# EAGLE design AUDIO_SHIELD (EAGLE 7.5.0)
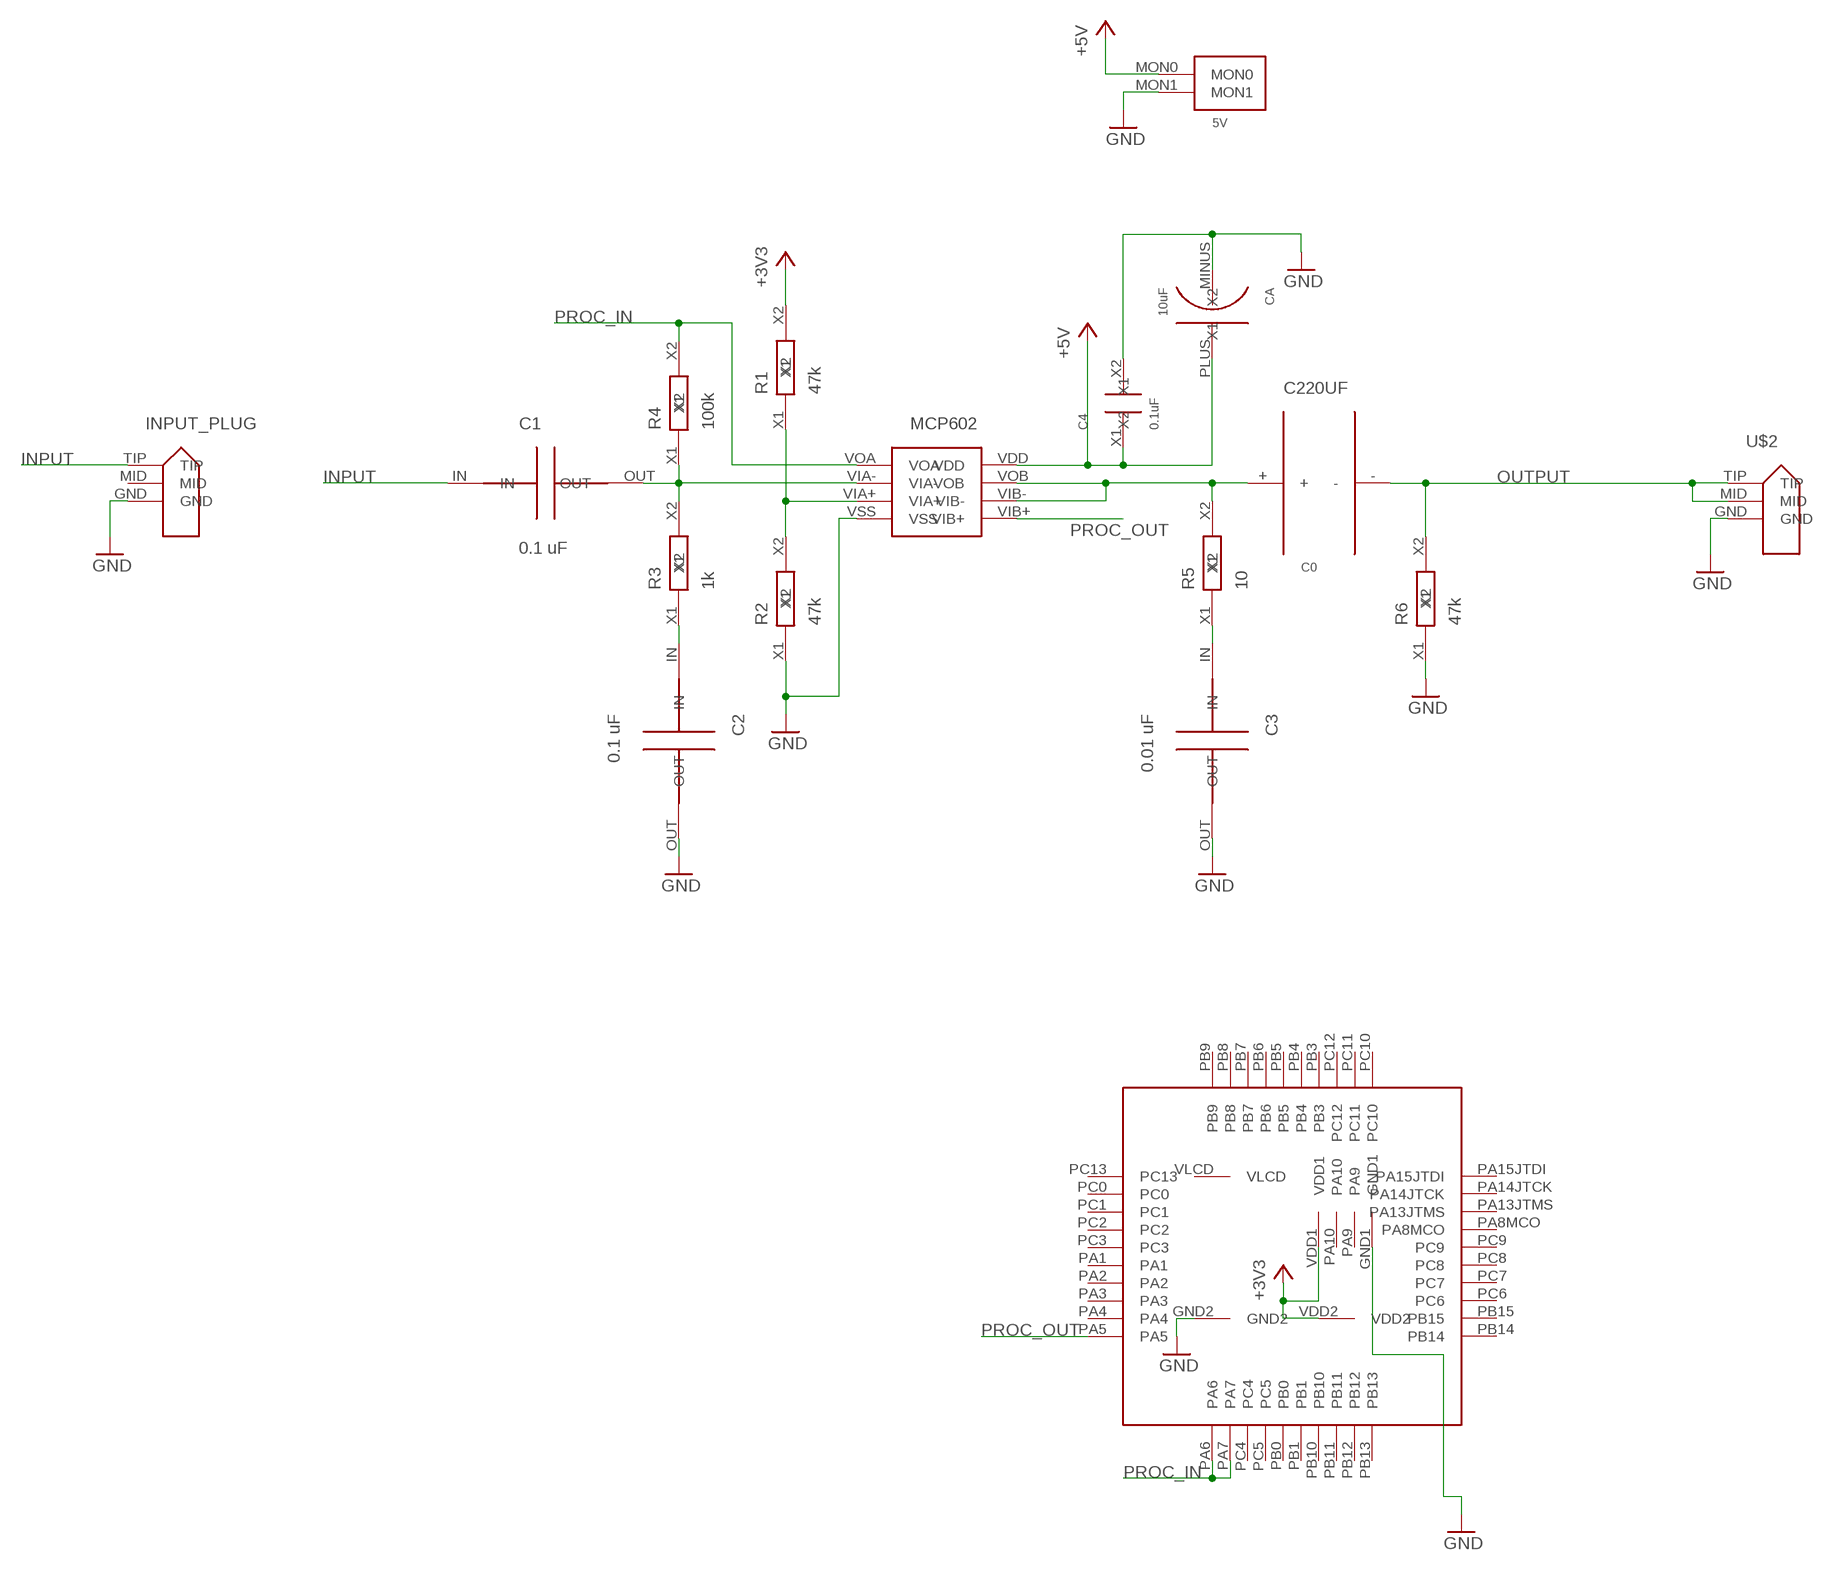
[diagram p0: schematic, sheet 1]

## Parts
5V  MON2PIN  [MON2PIN]
C0  C220UF  C100UF  [C100UF]
C1  0.1 uF  C_CER_5MM  [C_CER_5MM]
C2  0.1 uF  C_CER_5MM  [C_CER_5MM]
C3  0.01 uF  C_CER_5MM  [C_CER_5MM]
C4  0.1uF  C_SMD_2.1X1.25  [SMD_2.1X1.25]
CA  10uF  C_SMD_TA_A  [C_SMD_TA_A]
INPUT_PLUG  AUDIOJACK_ST215N  [AUDIOJACK_ST215N]
MCP602  MCP602  [MCP602]
R1  47k  R_SMD_2.1X1.25  [SMD_2.1X1.25]
R2  47k  R_SMD_2.1X1.25  [SMD_2.1X1.25]
R3  1k  R_SMD_2.1X1.25  [SMD_2.1X1.25]
R4  100k  R_SMD_2.1X1.25  [SMD_2.1X1.25]
R5  10  R_SMD_2.1X1.25  [SMD_2.1X1.25]
R6  47k  R_SMD_2.1X1.25  [SMD_2.1X1.25]
U$1  STM32L1_ADAPTER  [STM32L1_ADAPTER]
U$2  AUDIOJACK_ST215N  [AUDIOJACK_ST215N]

## Nets
+3V3: R1.X2 U$1.VDD1 U$1.VDD2
+5V: 5V.MON0 C4.X1 CA.PLUS(X2) MCP602.VDD
GND: 5V.MON1 C2.OUT C3.OUT C4.X2 CA.MINUS(X1) INPUT_PLUG.GND MCP602.VSS R2.X1 R6.X1 U$1.GND1 U$1.GND2 U$2.GND
INPUT: C1.IN INPUT_PLUG.TIP
N$1: MCP602.VIA+ R1.X1 R2.X2
N$2: C2.IN R3.X1
N$3: C3.IN R5.X1
N$9: C0.+ MCP602.VIB- MCP602.VOB R5.X2
N$10: C1.OUT MCP602.VIA- R3.X2 R4.X1
OUTPUT: C0.- R6.X2 U$2.MID U$2.TIP
PROC_IN: MCP602.VOA R4.X2 U$1.PA6 U$1.PA7
PROC_OUT: MCP602.VIB+ U$1.PA5
Unconnected: INPUT_PLUG.MID U$1.PA1 U$1.PA2 U$1.PA3 U$1.PA4 U$1.PA8MCO U$1.PA9 U$1.PA10 U$1.PA13JTMS U$1.PA14JTCK U$1.PA15JTDI U$1.PB0 U$1.PB1 U$1.PB3 U$1.PB4 U$1.PB5 U$1.PB6 U$1.PB7 U$1.PB8 U$1.PB9 U$1.PB10 U$1.PB11 U$1.PB12 U$1.PB13 U$1.PB14 U$1.PB15 U$1.PC0 U$1.PC1 U$1.PC2 U$1.PC3 U$1.PC4 U$1.PC5 U$1.PC6 U$1.PC7 U$1.PC8 U$1.PC9 U$1.PC10 U$1.PC11 U$1.PC12 U$1.PC13 U$1.VLCD

## Library data of the parts
5V = MyCMOSsensor:MON2PIN
C0 = MyAmps:C100UF
C1-C3 = MyDuino:C_CER_5MM
C4 = MyPowerComponents:C_SMD_2.1X1.25
CA = MyAmSys:C_SMD_TA_A
INPUT_PLUG U$2 = MyAmps:AUDIOJACK_ST215N
MCP602 = MyAmps:MCP602
R1-R6 = MyPowerComponents:R_SMD_2.1X1.25
U$1 = My_STM32F767:STM32L1_ADAPTER

## Board
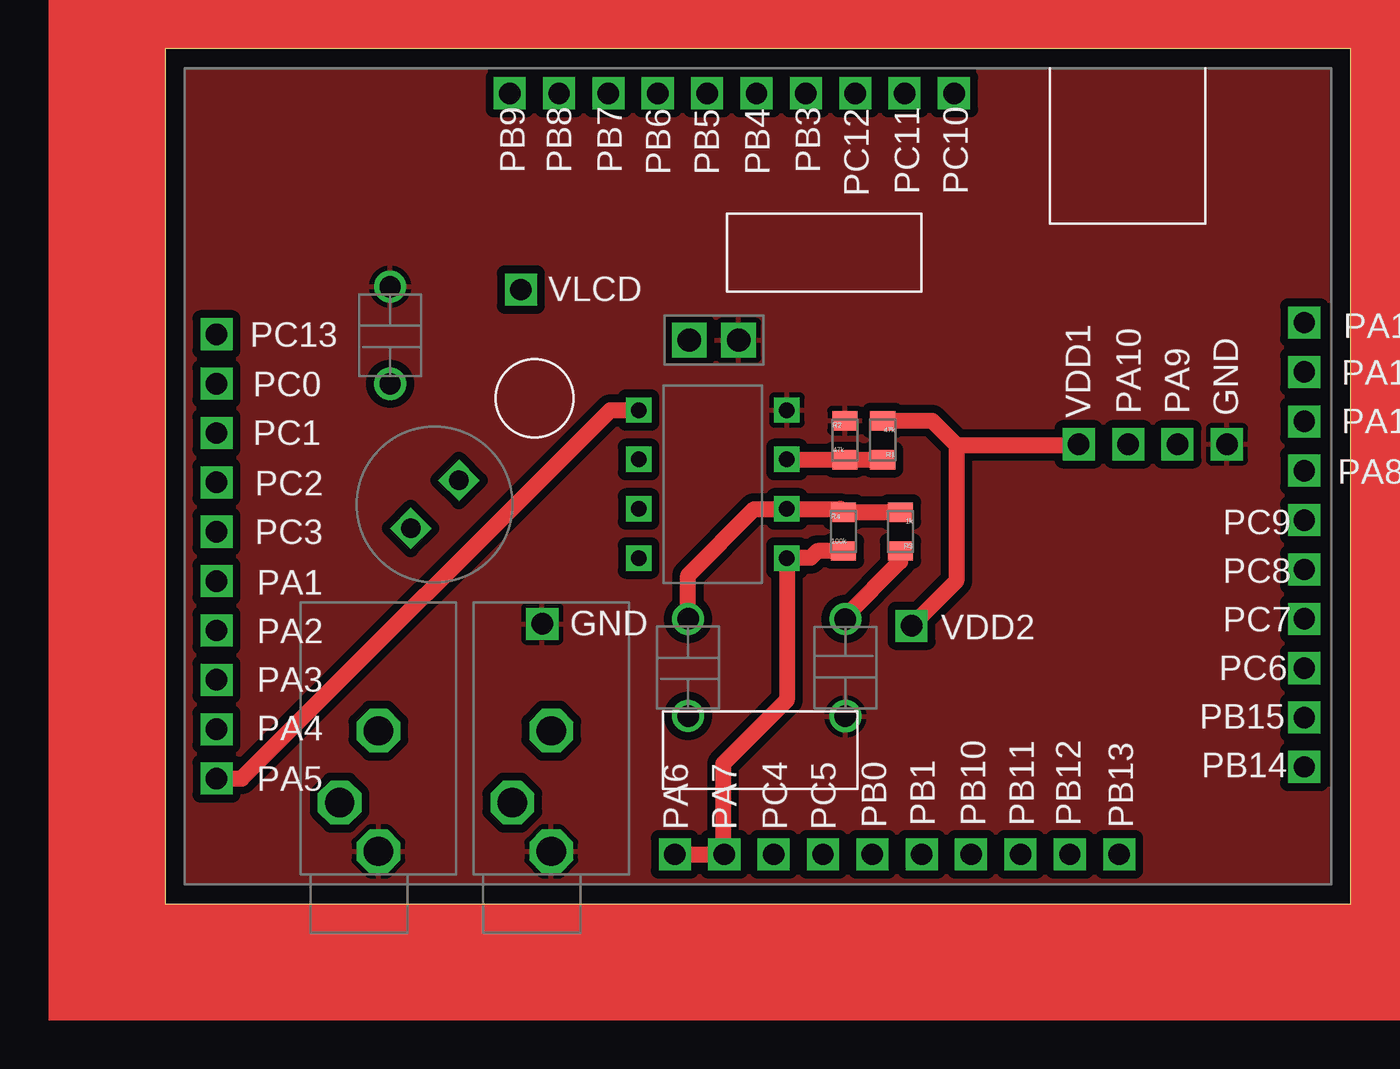
[diagram p1: board, top side]
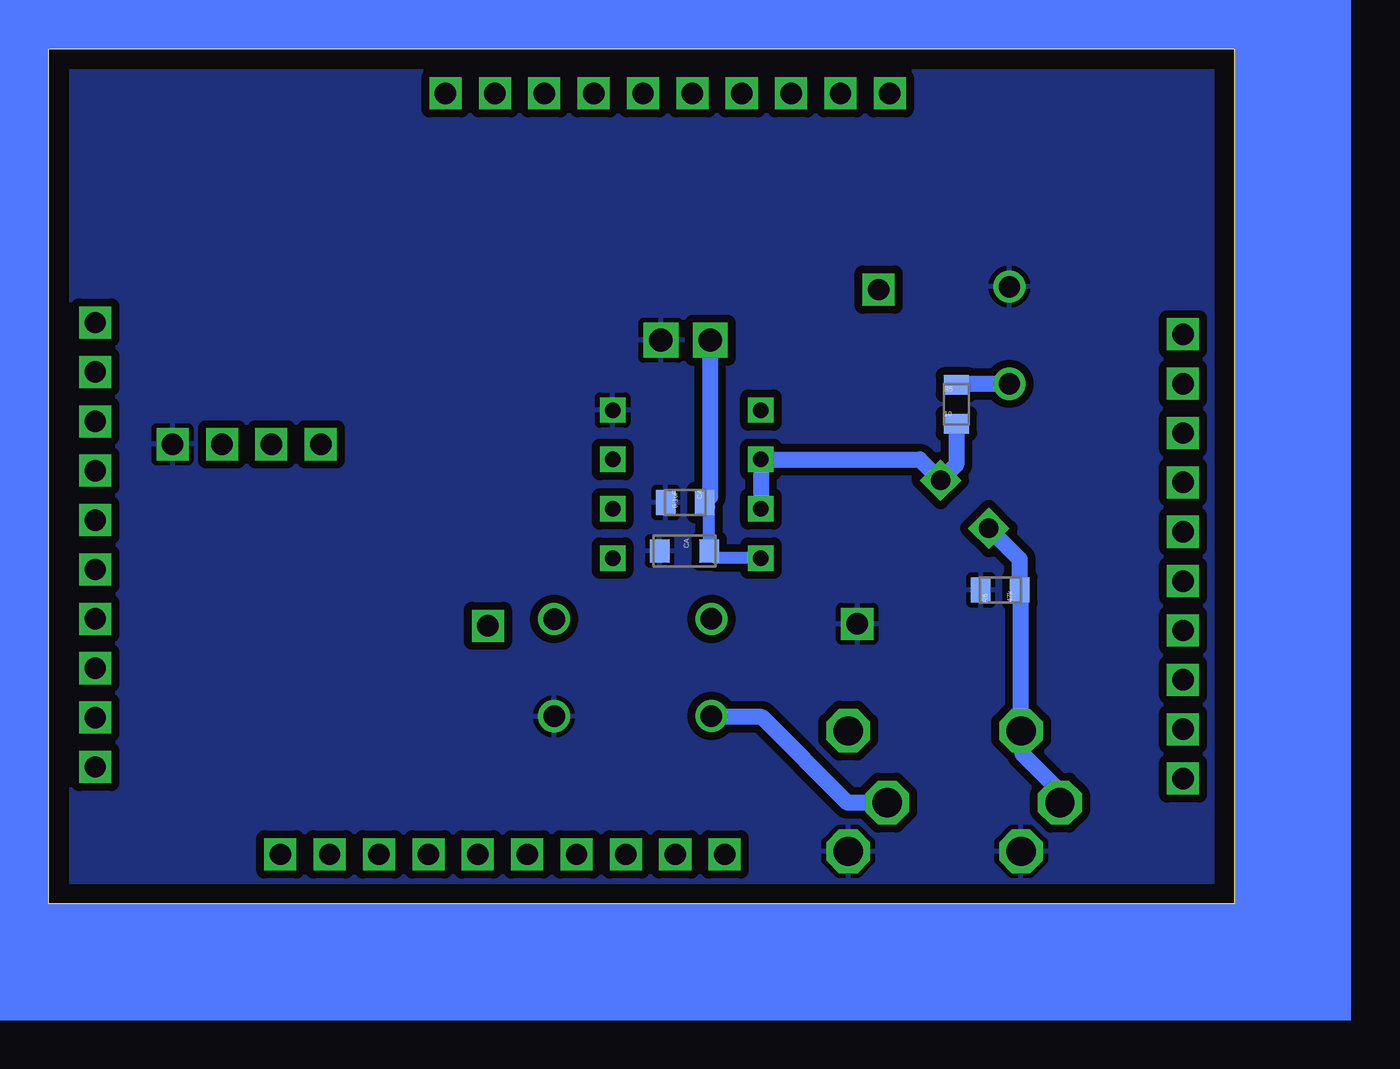
[diagram p2: board, bottom side, seen from below]

Size 61 x 44 mm. Coordinates in mm from the lower left corner, seen from the top.
Outline: 0,0 61,0 61,44 0,44 0,0
Copper layers (1*16): Top 0.035mm / dielectric 1.5mm / Bottom 0.035mm
Design rules "default": minimum track width 10mil, minimum drill 24mil, track to track 8mil, track to pad 8mil, pad to pad 8mil, via to via 8mil, smd to smd 8mil, copper to edge 40mil, drill to drill 8mil, minimum pad ring 10mil, minimum via ring 8mil, stop-mask expansion 4mil, vias tented up to drill 0mil, thermal gap 10mil

### Footprints (pad centres in the part's own frame; a part is rotated, then mirrored left to right if it is on the bottom)
MON2PIN = drill 1.2 square: MON0 0,2.54; MON1 0,0
C100UF = drill 1 square: + -1.75,0; - 1.75,0
C_CER_5MM = drill 1.1: IN -2.5,0; OUT 2.5,0
SMD_2.1X1.25 = smd 1.3 x 1: X1 0,1; X2 0,-1
C_SMD_TA_A = smd 1.2 x 1: MINUS 0,-1.27; PLUS 0,1.27
AUDIOJACK_ST215N = drill 1.5 octagon: GND 1.2,4; MID 7.4,4; TIP 3.7,6
MCP602 = drill 0.8 square: VDD 3.81,3.81; VIA+ -3.81,-1.27; VIA- -3.81,1.27; VIB+ 3.81,-3.81; VIB- 3.81,-1.27; VOA -3.81,3.81; VOB 3.81,1.27; VSS -3.81,-3.81
STM32L1_ADAPTER = drill 1.1 square: GND1 53.62,22.64; GND2 18.4,13.4; PA1 1.64,15.6; PA2 1.64,13.06; PA3 1.64,10.52; PA4 1.64,7.98; PA5 1.64,5.44; PA6 25.22,1.54; PA7 27.76,1.54; PA8MCO 57.6,21.28; PA9 51.08,22.64; PA10 48.54,22.64; PA13JTMS 57.6,23.82; PA14JTCK 57.6,26.36; PA15JTDI 57.6,28.9; PB0 35.38,1.54; PB1 37.92,1.54; PB3 31.96,40.7; PB4 29.42,40.7; PB5 26.88,40.7; PB6 24.34,40.7; PB7 21.8,40.7; PB8 19.26,40.7; PB9 16.72,40.7; PB10 40.46,1.54; PB11 43,1.54; PB12 45.54,1.54; PB13 48.08,1.54; PB14 57.6,6.04; PB15 57.6,8.58; PC0 1.64,25.76; PC1 1.64,23.22; PC2 1.64,20.68; PC3 1.64,18.14; PC4 30.3,1.54; PC5 32.84,1.54; PC6 57.6,11.12; PC7 57.6,13.66; PC8 57.6,16.2; PC9 57.6,18.74; PC10 39.58,40.7; PC11 37.04,40.7; PC12 34.5,40.7; PC13 1.64,28.3; VDD1 46,22.64; VDD2 37.4,13.3; VLCD 17.3,30.6

### Placement (x,y rotation side)
5V  29.5,29 90 top
C0  13.87,20.55 225 top
C1  26.9,12.16 90 top
C2  34.99,12.15 270 top
C3  11.57,29.25 90 top
C4  28.25,20.65 270 bottom
CA  28.29,18.15 270 bottom
INPUT_PLUG  23.86,1.5 90 top
MCP602  28.17,21.59 180 top
R1  36.91,23.85 180 top
R2  34.97,23.85 0 top
R3  37.83,19.15 180 top
R4  34.89,19.15 0 top
R5  14.3,25.7 0 bottom
R6  12.04,16.14 90 bottom
U$1  1,1 0 top
U$2  14.97,1.5 90 top

### Tracks (layer width: path | path; a pad name or v marks a point on that pad's centre or on a via)
+3V3
  Top 0.813: R1.X2 39.45,24.85 40.7,23.6 | 40.7,23.6 46.96,23.6 U$1.VDD1 | 40.7,23.6 40.7,16.6 U$1.VDD2
+5V
  Bottom 0.61: MCP602.VDD 26.65,17.78 CA.PLUS 27.02,20.42 C4.X1
  Bottom 0.813: 5V.MON0 26.96,20.94 C4.X1
GND
  pour Bottom (isolate 0.406): 1,1 60,1 60,43 1,43
  pour Top (isolate 0.406): 1,1 60,1 60,43 1,43
INPUT
  Bottom 0.813: INPUT_PLUG.TIP 19.9,5.2 24.3,9.6 26.84,9.6 C1.IN
N$1
  Top 0.813: MCP602.VIA+ R2.X2 R1.X1
N$2
  Top 0.813: C2.IN 34.99,14.79 37.8,17.6 37.8,18.12 R3.X1
N$3
  Bottom 0.813: C3.IN 14.25,26.75 R5.X1
N$9
  Bottom 0.813: MCP602.VOB MCP602.VIB- 16.18,22.86 C0.+ 14.3,22.59 R5.X2
N$10
  Top 0.813: C1.OUT 26.9,16.9 30.3,20.3 31.96,20.3 MCP602.VIA- 34.72,20.32 R4.X1 R3.X2
OUTPUT
  Bottom 0.813: U$2.TIP 8.97,5.77 10.9,7.7 10.9,8.83 U$2.MID 10.97,16.07 R6.X2 11.04,17.72 C0.-
PROC_IN
  Top 0.813: U$1.PA6 U$1.PA7 28.7,2.6 28.7,7.2 31.98,10.48 MCP602.VOA 32,17.8 33.2,17.8 33.55,18.15 R4.X2
PROC_OUT
  Top 0.813: U$1.PA5 3.94,6.44 22.9,25.4 MCP602.VIB+
(copper drawn outside any net)
  shapes: Bottom area x4, Top area x5